# Altium project 0068_Marquee.PrjPcb
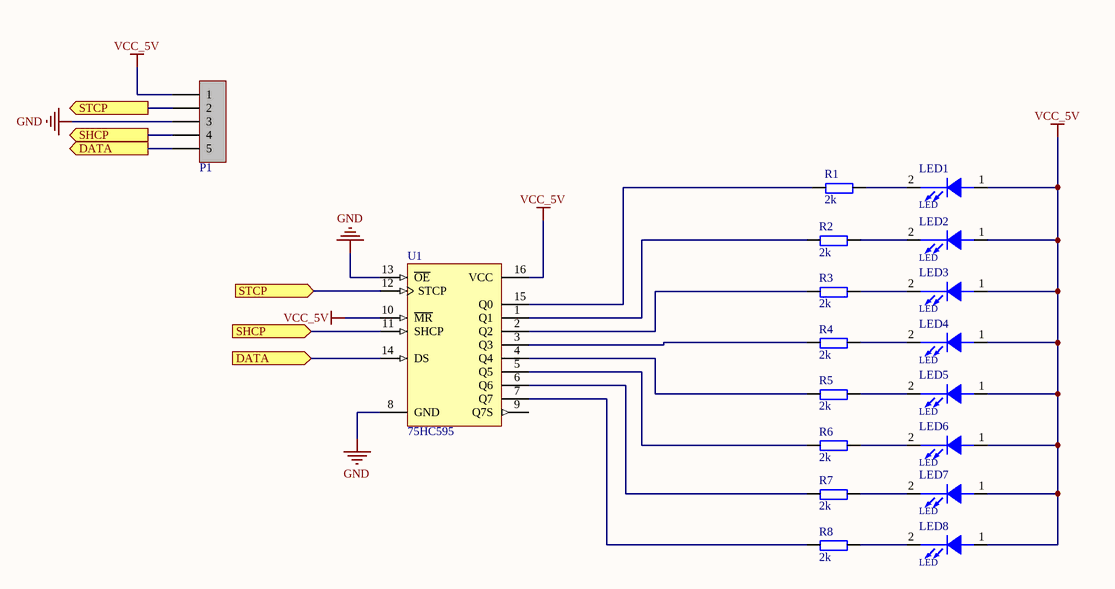
[diagram p0: 0068_Marquee.SchDoc]
1 sheet, 18 parts. Net scope: flat (ports and power ports of the same name join across sheets).
Board file: 0068Marquee.PcbDoc

## Sheet 0068_Marquee.SchDoc
size A4

### Parts
LED1  LED  [SMDLED-0603]
LED2  LED  [SMDLED-0603]
LED3  LED  [SMDLED-0603]
LED4  LED  [SMDLED-0603]
LED5  LED  [SMDLED-0603]
LED6  LED  [SMDLED-0603]
LED7  LED  [SMDLED-0603]
LED8  LED  [SMDLED-0603]
P1  CON5_1  [HDR5X1_B]  (value not drawn)
R1  2k  [0603P]
R2  2k  [0603P]
R3  2k  [0603P]
R4  2k  [0603P]
R5  2k  [0603P]
R6  2k  [0603P]
R7  2k  [0603P]
R8  2k  [0603P]
U1  75HC595  [SOT763-1]

### Ports
DATA (in), DATA (out), SHCP (in), SHCP (out), STCP (in), STCP (out)

### Nets
GND: P1.3 U1.8(GND) U1.13(~{OE})
VCC_5V: LED1.1(ANODE) LED2.1(ANODE) LED3.1(ANODE) LED4.1(ANODE) LED5.1(ANODE) LED6.1(ANODE) LED7.1(ANODE) LED8.1(ANODE) P1.1 U1.10(~{MR}) U1.16(VCC)
NetLED1_2: LED1.2(CATHODE) R1.2
NetLED2_2: LED2.2(CATHODE) R2.2
NetLED3_2: LED3.2(CATHODE) R3.2
NetLED4_2: LED4.2(CATHODE) R4.2
NetLED5_2: LED5.2(CATHODE) R5.2
NetLED6_2: LED6.2(CATHODE) R6.2
NetLED7_2: LED7.2(CATHODE) R7.2
NetLED8_2: LED8.2(CATHODE) R8.2
NetP1_2: P1.2 U1.12(STCP) ; port STCP
NetP1_4: P1.4 U1.11(SHCP) ; port SHCP
NetP1_5: P1.5 U1.14(DS) ; port DATA
NetR1_1: R1.1 U1.15(Q0)
NetR2_1: R2.1 U1.1(Q1)
NetR3_1: R3.1 U1.2(Q2)
NetR4_1: R4.1 U1.3(Q3)
NetR5_1: R5.1 U1.4(Q4)
NetR6_1: R6.1 U1.5(Q5)
NetR7_1: R7.1 U1.6(Q6)
NetR8_1: R8.1 U1.7(Q7)

Not connected (* = marked no-connect by the designer): U1 9(Q7S)

### Library data of the parts
LED1-LED8 = LED: Right: 40; Bottom: 20
P1 = CON5_1: Connector
R1-R8 = R: 贴片电阻
U1 = 74HC595: IC 8BIT SHIFT REGISTER 16-DHVQFN